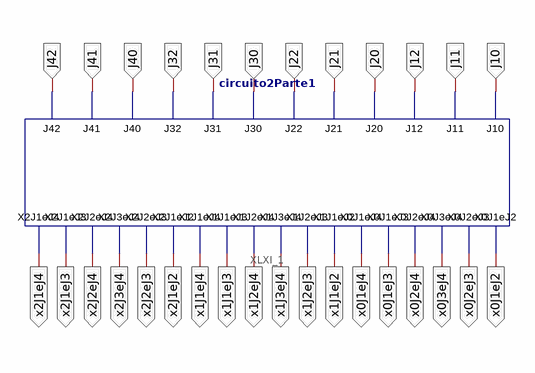
[diagram p0: schematic sheet 1]
// Xilinx ISE schematic c2p1teste.sch (spartan6) as structural Verilog: 1 symbols, 30 ports
module c2p1teste (
  input  J42,
  input  J41,
  input  J40,
  input  J32,
  input  J31,
  input  J30,
  input  J22,
  input  J21,
  input  J20,
  input  J12,
  input  J11,
  input  J10,
  output x2J1eJ4,
  output x2J1eJ3,
  output x2J2eJ4,
  output x2J3eJ4,
  output x2J2eJ3,
  output x2J1eJ2,
  output x1J1eJ4,
  output x1J1eJ3,
  output x1J2eJ4,
  output x1J3eJ4,
  output x1J2eJ3,
  output x1J1eJ2,
  output x0J1eJ4,
  output x0J1eJ3,
  output x0J2eJ4,
  output x0J3eJ4,
  output x0J2eJ3,
  output x0J1eJ2
);

  circuito2Parte1 XLXI_1 (
    .J10(J10), .J11(J11), .J12(J12), .J20(J20), .J21(J21), .J22(J22), .J30(J30), .J31(J31), .J32(J32),
    .J40(J40), .J41(J41), .J42(J42), .X0J1eJ2(x0J1eJ2), .X0J2eJ3(x0J2eJ3), .X0J3eJ4(x0J3eJ4),
    .X0J2eJ4(x0J2eJ4), .X0J1eJ3(x0J1eJ3), .X0J1eJ4(x0J1eJ4), .X1J1eJ2(x1J1eJ2), .X1J2eJ3(x1J2eJ3),
    .X1J3eJ4(x1J3eJ4), .X1J2eJ4(x1J2eJ4), .X1J1eJ3(x1J1eJ3), .X1J1eJ4(x1J1eJ4), .X2J1eJ2(x2J1eJ2),
    .X2J2eJ3(x2J2eJ3), .X2J3eJ4(x2J3eJ4), .X2J2eJ4(x2J2eJ4), .X2J1eJ3(x2J1eJ3), .X2J1eJ4(x2J1eJ4));
endmodule
